# EAGLE schematic DIS06043H-ESP32-V2.020231204 (EAGLE 9.5.1)
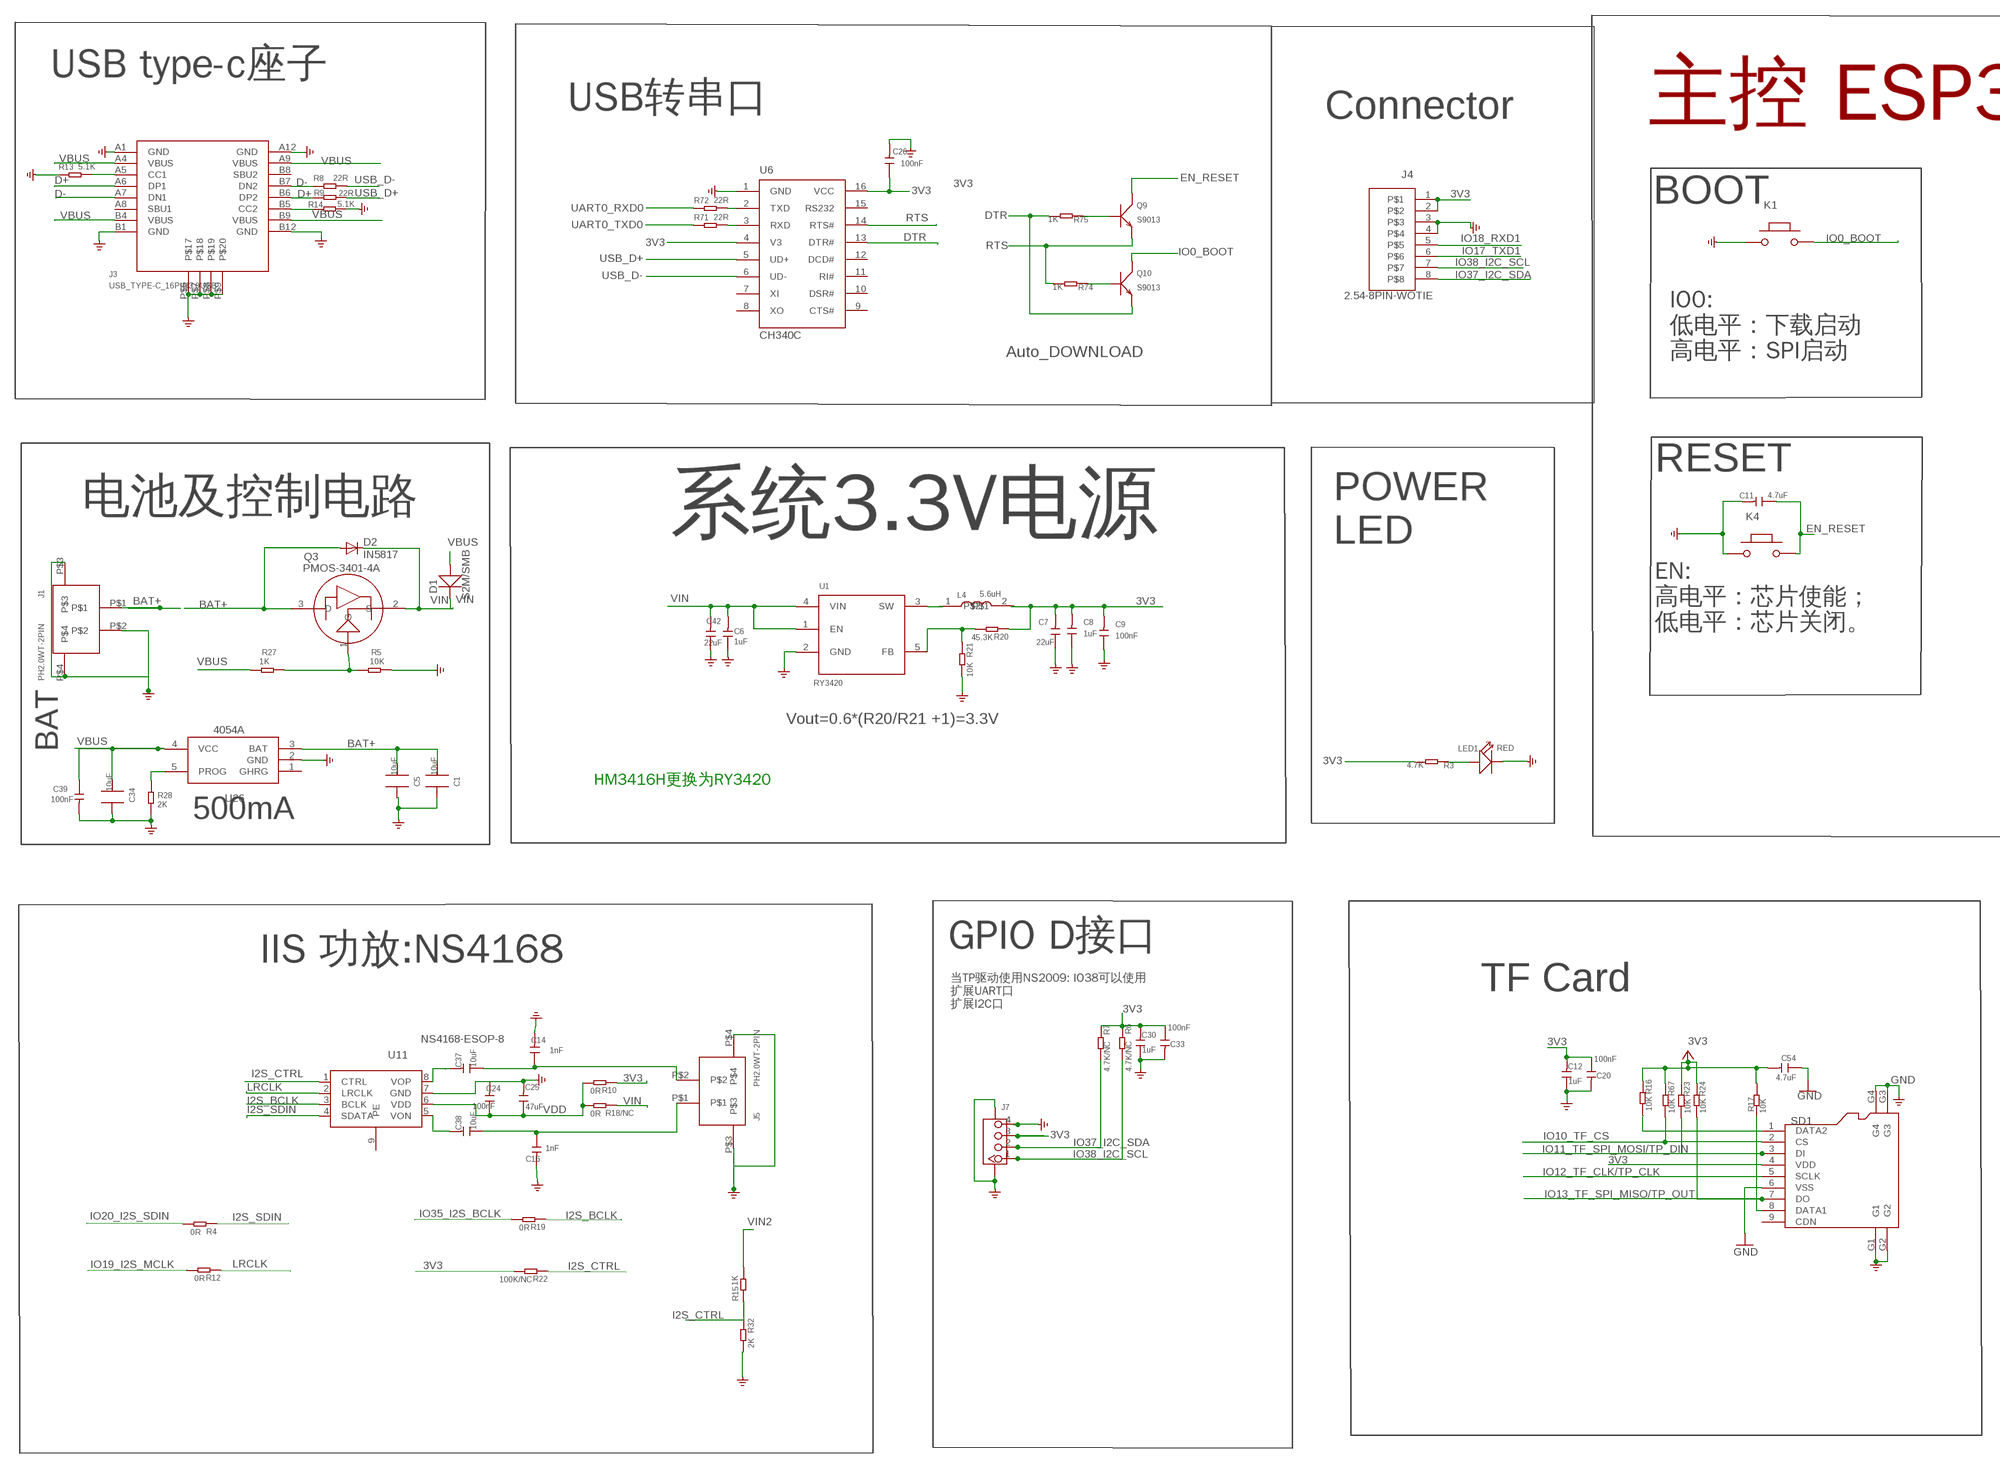
[diagram p0: schematic, sheet 1, part 1 of 2]
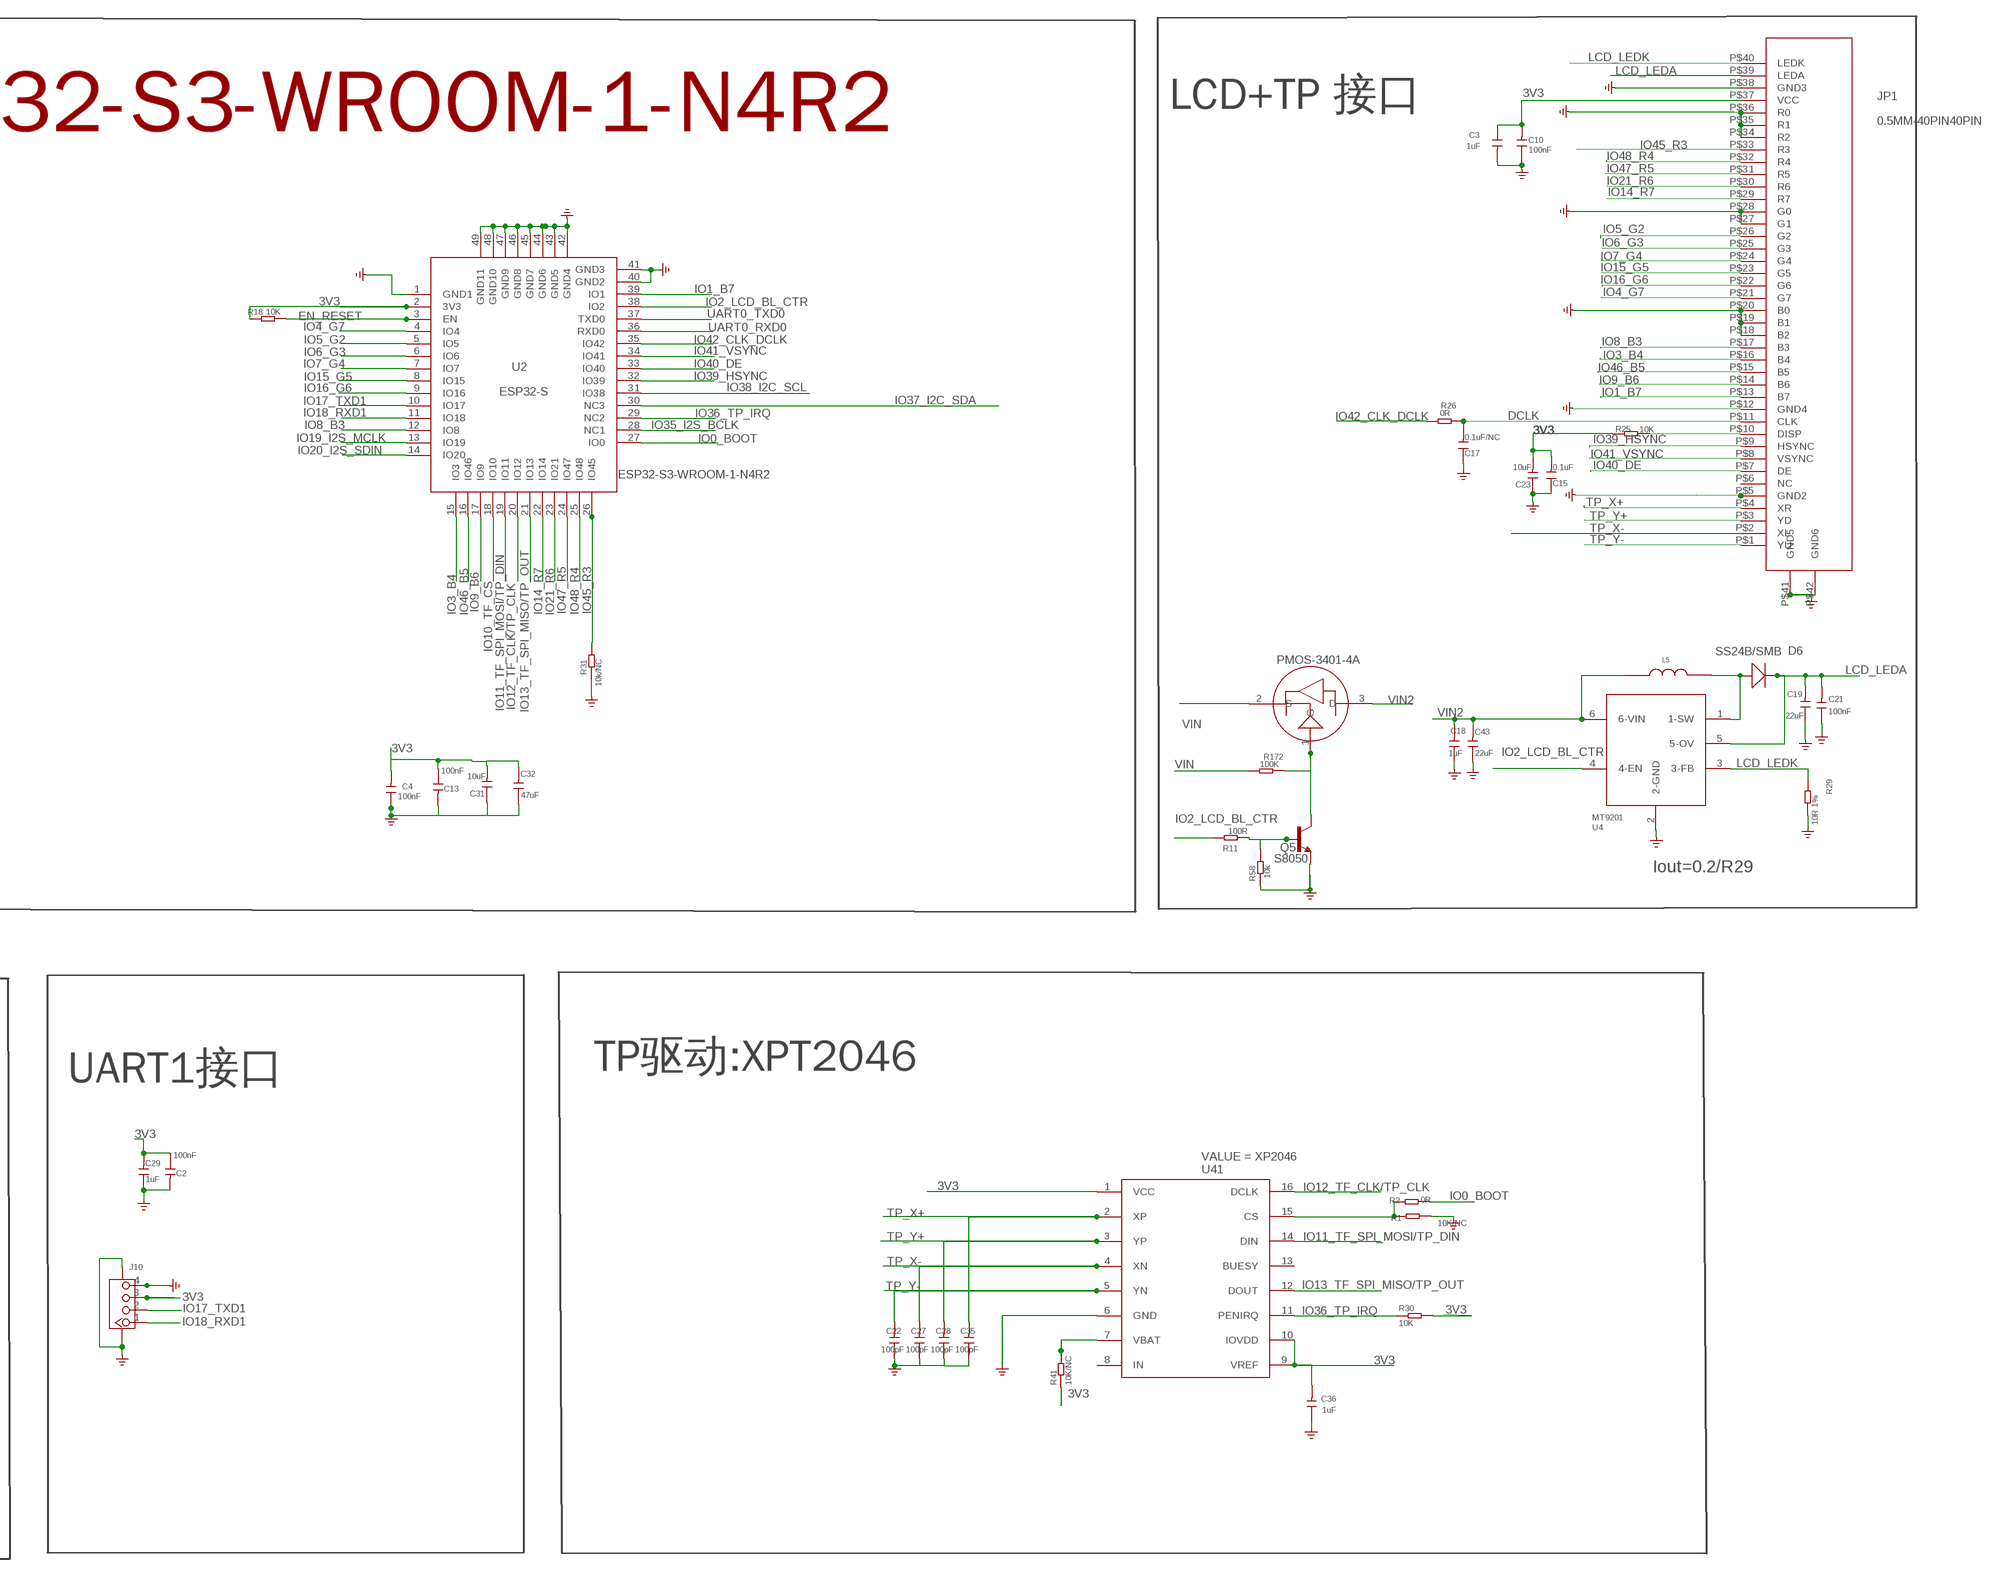
[diagram p1: schematic, sheet 1, part 2 of 2]

## Parts
C1  10uF  C0805_S  [0805_S]
C2  100nF  C-0603  [C0603]
C3  1uF  C-0603  [C0603]
C4  100nF  C-0603  [C0603]
C5  10uF  C0805_S  [0805_S]
C6  1uF  C0603  [0603]
C7  22uF  C0805  [0805]
C8  1uF  C0603  [0603]
C9  100nF  C0603  [0603]
C10  100nF  C-0603  [C0603]
C11  4.7uF  C0603  [0603]
C12  1uF  DISCRETE_C-0603  [DISCRETE_C0603]
C13  100nF  C-0603  [C0603]
C14  1nF  C-0603  [C0603]
C15  0.1uF  DISCRETE_C-0603  [DISCRETE_C0603]
C16  1nF  C-0603  [C0603]
C17  0.1uF/NC  DISCRETE_C-0603  [DISCRETE_C0603]
C18  1uF  C0603  [0603]
C19  22uF  C0805  [0805]
C20  100nF  C-0603  [C0603]
C21  100nF  C0603  [0603]
C22  100pF  C0603  [0603]
C23  10uF  DISCRETE_C-0603  [DISCRETE_C0603]
C24  100nF  C-0603  [C0603]
C25  47uF  C0805  [0805]
C26  100nF  C0603  [0603]
C27  100pF  C0603  [0603]
C28  100pF  C0603  [0603]
C29  1uF  DISCRETE_C-0603  [DISCRETE_C0603]
C30  1uF  DISCRETE_C-0603  [DISCRETE_C0603]
C31  10uF  DISCRETE_C-0603  [DISCRETE_C0603]
C32  47uF  C0805  [0805]
C33  100nF  C-0603  [C0603]
C34  10uF  C0805_S  [0805_S]
C35  100pF  C0603  [0603]
C36  1uF  DISCRETE_C-0603  [DISCRETE_C0603]
C37  10uF  DISCRETE_C-0603  [DISCRETE_C0603]
C38  10uF  DISCRETE_C-0603  [DISCRETE_C0603]
C39  100nF  C-0603  [C0603]
C42  22uF  C0805  [0805]
C43  22uF  C0805  [0805]
C54  4.7uF  DISCRETE_C-0603  [DISCRETE_C0603]
D1  S2M/SMB  214ABDO-214AB  [214AB]
D2  IN5817  DIODE-DO-214AC  [DO-214AC]
D6  SS24B/SMB  214ABDO-214AB  [214AB]
J1  PH2.0WT-2PIN  [PH2.0WT-2PIN]
J3  USB_TYPE-C_16PIN3.0USB  [KEVIN_3.0TYPEC-SMD]
J4  2.54-8PIN-WOTIE  [2.54-8P-WOTIE]
J5  PH2.0WT-2PIN  [PH2.0WT-2PIN]
J7  CONNECTOR_TWIG-4P-2.0-SMD-FEMALE-REINFORCE90D  [CONNECTOR_4P-SMD-2.0-90D]
J10  CONNECTOR_TWIG-4P-2.0-SMD-FEMALE-REINFORCE90D  [CONNECTOR_4P-SMD-2.0-90D]
JP1  0.5MM-40PIN40PIN  [0.5MM*40P]
K1  BUTTON  PB157  [157SW]
K4  BUTTON  PB157  [157SW]
L4  5.6uH  L-0530  [CD54_CD54]
L5  CD32_6.8uH  CD32_950MA  [CD32]
LED1  RED  DISCRETE_LED0603  [DISCRETE_LED-0603]
Q3  PMOS-3401-4A  P-MOS-SOT23  [SOT-23]
Q5  S8050  SPARKFUN_TRANSISTOR_NPNSOT23  [SPARKFUN_SOT23]
Q9  S9013  TRANSISTOR-NPN-SOT23  [SOT23@1]
Q10  S9013  TRANSISTOR-NPN-SOT23  [SOT23@1]
Q30  PMOS-3401-4A  P-MOS-SOT23  [SOT-23]
R1  10K/NC  R0603  [R0603]
R2  0R  DISCRETE_R-0603  [DISCRETE_R0603]
R3  4.7K  DISCRETE_R-0603  [DISCRETE_R0603]
R4  0R  DISCRETE_R-0603  [DISCRETE_R0603]
R5  10K  DISCRETE_R-0603  [DISCRETE_R0603]
R6  4.7K/NC  DISCRETE_R-0603  [DISCRETE_R0603]
R7  4.7K/NC  DISCRETE_R-0603  [DISCRETE_R0603]
R8  22R  DISCRETE_R-0603  [DISCRETE_R0603]
R9  22R  DISCRETE_R-0603  [DISCRETE_R0603]
R10  0R  DISCRETE_R-0603  [DISCRETE_R0603]
R11  100R  R0603  [R0603]
R12  0R  DISCRETE_R-0603  [DISCRETE_R0603]
R13  5.1K  DISCRETE_R-0603  [DISCRETE_R0603]
R14  5.1K  DISCRETE_R-0603  [DISCRETE_R0603]
R15  1K  DISCRETE_R-0603  [DISCRETE_R0603]
R16  10K  DISCRETE_R-0603  [DISCRETE_R0603]
R17  10K  DISCRETE_R-0603  [DISCRETE_R0603]
R18  10K  DISCRETE_R-0603  [DISCRETE_R0603]
R18/NC  0R  DISCRETE_R-0603  [DISCRETE_R0603]
R19  0R  DISCRETE_R-0603  [DISCRETE_R0603]
R20  45.3K  DISCRETE_R-0603  [DISCRETE_R0603]
R21  10K  DISCRETE_R-0603  [DISCRETE_R0603]
R22  100K/NC  DISCRETE_R-0603  [DISCRETE_R0603]
R23  10K  DISCRETE_R-0603  [DISCRETE_R0603]
R24  10K  DISCRETE_R-0603  [DISCRETE_R0603]
R25  10K  DISCRETE_R-0603  [DISCRETE_R0603]
R26  0R  R-0603  [R0603]
R27  1K  DISCRETE_R-0603  [DISCRETE_R0603]
R28  2K  DISCRETE_R-0603  [DISCRETE_R0603]
R29  10R 1%  DISCRETE_R-0603  [DISCRETE_R0603]
R30  10K  DISCRETE_R-0603  [DISCRETE_R0603]
R31  10k/NC  R0603  [R0603]
R32  2K  DISCRETE_R-0603  [DISCRETE_R0603]
R41  10K/NC  DISCRETE_R-0603  [DISCRETE_R0603]
R58  10k  R0603  [R0603]
R67  10K  DISCRETE_R-0603  [DISCRETE_R0603]
R71  22R  DISCRETE_R-0603  [DISCRETE_R0603]
R72  22R  DISCRETE_R-0603  [DISCRETE_R0603]
R74  1K  DISCRETE_R-0603  [DISCRETE_R0603]
R75  1K  DISCRETE_R-0603  [DISCRETE_R0603]
R172  100K  R-0603  [R0603]
SD1  HOLDER-MICROSD-9P  [9P-SMD-W/-RING]
U1  RY3420  A_XBJ_HM3420B  [A_XBJ_SOT23-5]
U2  ESP32-S  [ESP32-S3]
U4  MT9201  [SOT23-6]
U6  CH340C  CH340G  [SOP-16]
U11  NS4168-ESOP-8  [NS4168-ESOP-8]
U26  4054A  [SOP23-5]
U41  XP2046  [XP2046-SSOP16]

## Nets
3V3: C2.1 C3.1 C4.2 C7.2 C8.2 C9.2 C10.2 C12.2 C13.1 C15.2 C20.1 C23.2 C26.1 C29.2 C30.2 C31.2 C32.2 C33.1 C36.2 C54.2 J4.1 J4.2 J7.3 J10.3 JP1.P$37(VCC) L4.2 R3.2 R6.1 R7.1 R10.1 R16.1 R17.1 R18.1 R20.1 R22.2 R23.1 R24.1 R25.1 R30.2 R41.1 R67.1 SD1.4(VDD) U2.2(3V3) U6.4(V3) U6.16(VCC) U41.1(VCC) U41.9(VREF) U41.10(IOVDD) ; supply symbol labelled +3V3
BAT+: C1.2 C5.2 D2.A J1.P$1 Q3.3(D) U26.3(BAT)
D+: J3.A6(DP1) J3.B6(DP2) R9.1
D-: J3.A7(DN1) J3.B7(DN2) R8.1
DCLK: C17.2 JP1.P$11(CLK) R26.2
DTR: Q10.2(E) R75.2 U6.13(DTR#)
EN_RESET: C11.1 K4.2 Q9.3(C) R18.2 U2.3(EN)
GND: C1.1 C2.2 C3.2 C4.1 C5.1 C6.1 C7.1 C8.1 C9.1 C10.1 C11.2 C12.1 C13.2 C14.2 C15.1 C16.2 C17.1 C18.1 C19.1 C20.2 C21.1 C22.1 C23.1 C24.2 C25.2 C26.2 C27.1 C28.1 C29.1 C30.1 C31.1 C32.1 C33.2 C34.1 C35.1 C36.1 C39.2 C42.1 C43.1 C54.1 J1.P$2 J1.P$3 J1.P$4 J3.A1(GND) J3.A12(GND) J3.B1(GND) J3.B12(GND) J3.P$6 J3.P$7 J3.P$8 J3.P$9 J4.3 J4.4 J5.P$3 J5.P$4 J7.4 J7.SS1 J7.SS2 J10.4 J10.SS1 J10.SS2 JP1.P$5(GND2) JP1.P$12(GND4) JP1.P$18(B2) JP1.P$19(B1) JP1.P$20(B0) JP1.P$27(G1) JP1.P$28(G0) JP1.P$34(R2) JP1.P$35(R1) JP1.P$36(R0) JP1.P$38(GND3) JP1.P$41(GND5) JP1.P$42(GND6) K1.1 K4.1 LED1.- Q5.2(E) R1.1 R5.1 R13.1 R14.2 R21.2 R28.2 R29.2 R31.1 R32.2 R58.1 SD1.6(VSS) SD1.G1 SD1.G2 SD1.G3 SD1.G4 U1.2(GND) U2.1(GND1) U2.40(GND2) U2.41(GND3) U2.42(GND4) U2.43(GND5) U2.44(GND6) U2.45(GND7) U2.46(GND8) U2.47(GND9) U2.48(GND10) U2.49(GND11) U4.2(2-GND) U6.1(GND) U11.7(GND) U26.2(GND) U41.6(GND)
I2S_BCLK: R19.1 U11.3(BCLK)
I2S_CTRL: R15.1 R22.1 R32.1 U11.1(CTRL)
I2S_SDIN: R4.1 U11.4(SDATA)
IO0_BOOT: K1.2 Q10.3(C) R2.1 U2.27(IO0)
IO1_B7: JP1.P$13(B7) U2.39(IO1)
IO2_LCD_BL_CTR: R11.2 U2.38(IO2) U4.4(4-EN)
IO3_B4: JP1.P$16(B4) U2.15(IO3)
IO4_G7: JP1.P$21(G7) U2.4(IO4)
IO5_G2: JP1.P$26(G2) U2.5(IO5)
IO6_G3: JP1.P$25(G3) U2.6(IO6)
IO7_G4: JP1.P$24(G4) U2.7(IO7)
IO8_B3: JP1.P$17(B3) U2.12(IO8)
IO9_B6: JP1.P$14(B6) U2.17(IO9)
IO10_TF_CS: R67.2 SD1.2(CS) U2.18(IO10)
IO11_TF_SPI_MOSI/TP_DIN: R23.2 SD1.3(DI) U2.19(IO11) U41.14(DIN)
IO12_TF_CLK/TP_CLK: SD1.5(SCLK) U2.20(IO12) U41.16(DCLK)
IO13_TF_SPI_MISO/TP_OUT: R24.2 SD1.7(DO) U2.21(IO13) U41.12(DOUT)
IO14_R7: JP1.P$29(R7) U2.22(IO14)
IO15_G5: JP1.P$23(G5) U2.8(IO15)
IO16_G6: JP1.P$22(G6) U2.9(IO16)
IO17_TXD1: J4.6 J10.2 U2.10(IO17)
IO18_RXD1: J4.5 J10.1 U2.11(IO18)
IO19_I2S_MCLK: R12.2 U2.13(IO19)
IO20_I2S_SDIN: R4.2 U2.14(IO20)
IO21_R6: JP1.P$30(R6) U2.23(IO21)
IO35_I2S_BCLK: R19.2 U2.28(NC1)
IO36_TP_IRQ: R30.1 U2.29(NC2) U41.11(PENIRQ)
IO37_I2C_SDA: J4.8 J7.2 R7.2 U2.30(NC3)
IO38_I2C_SCL: J4.7 J7.1 R6.2 U2.31(IO38)
IO39_HSYNC: JP1.P$9(HSYNC) U2.32(IO39)
IO40_DE: JP1.P$7(DE) U2.33(IO40)
IO41_VSYNC: JP1.P$8(VSYNC) U2.34(IO41)
IO42_CLK_DCLK: R26.1 U2.35(IO42)
IO45_R3: JP1.P$33(R3) R31.2 U2.26(IO45)
IO46_B5: JP1.P$15(B5) U2.16(IO46)
IO47_R5: JP1.P$31(R5) U2.24(IO47)
IO48_R4: JP1.P$32(R4) U2.25(IO48)
LCD_LEDA: C19.2 C21.2 D6.2(-) JP1.P$39(LEDA) U4.5(5-OV)
LCD_LEDK: JP1.P$40(LEDK) R29.1 U4.3(3-FB)
LRCLK: R12.1 U11.2(LRCLK)
N$1: LED1.+ R3.1
N$2: R41.2 U41.7(VBAT)
N$3: C37.2 U11.8(VOP)
N$6: C14.1 C37.1 J5.P$2
N$7: JP1.P$10(DISP) R25.2
N$9: R1.2 R2.2 U41.15(CS)
N$10: C16.1 C38.1 J5.P$1
N$11: J3.A5(CC1) R13.2
N$12: C38.2 U11.5(VON)
N$13: L4.1 U1.3(SW)
N$14: R28.1 U26.5(PROG)
N$15: Q3.1(G) R5.2 R27.1
N$16: D6.1(+) L5.2 U4.1(1-SW)
N$17: J3.B5(CC2) R14.1
N$20: R20.2 R21.1 U1.5(FB)
N$23: Q5.1(B) R11.1 R58.2
N$32: Q9.1(B) R75.1
N$36: Q5.3(C) Q30.1(G) R172.2
N$38: Q10.1(B) R74.1
N$40: R72.2 U6.2(TXD)
N$42: R71.2 U6.3(RXD)
N$47: R16.2 SD1.1(DATA2)
N$48: R17.2 SD1.8(DATA1)
RTS: Q9.2(E) R74.2 U6.14(RTS#)
TP_X+: C35.2 JP1.P$4(XR) U41.2(XP)
TP_X-: C27.2 JP1.P$2(XL) U41.4(XN)
TP_Y+: C28.2 JP1.P$3(YD) U41.3(YP)
TP_Y-: C22.2 JP1.P$1(YU) U41.5(YN)
UART0_RXD0: R72.1 U2.36(RXD0)
UART0_TXD0: R71.1 U2.37(TXD0)
USB_D+: R9.2 U6.5(UD+)
USB_D-: R8.2 U6.6(UD-)
VBUS: C34.2 C39.1 D1.1(+) J3.A4(VBUS) J3.A9(VBUS) J3.B4(VBUS) J3.B9(VBUS) R27.2 U26.4(VCC)
VDD: C24.1 C25.1 R10.2 R18/NC.2 U11.6(VDD)
VIN: C6.2 C42.2 D1.2(-) D2.C Q3.2(S) Q30.2(S) R18/NC.1 R172.1 U1.1(EN) U1.4(VIN)
VIN2: C18.2 C43.2 L5.1 Q30.3(D) R15.2 U4.6(6-VIN)
Unconnected: J3.A8(SBU1) J3.B8(SBU2) JP1.P$6(NC) SD1.9(CDN) U6.7(XI) U6.8(XO) U6.9(CTS#) U6.10(DSR#) U6.11(RI#) U6.12(DCD#) U6.15(RS232) U11.9(PE) U26.1(GHRG) U41.8(IN) U41.13(BUESY)

## Notes on the sheet
- USB type-c座子
- USB转串口 | LCD+TP 接口
- Connector | 主控 ESP32-S3-WROOM-1-N4R2
- BOOT
- Auto_DOWNLOAD
- IO0:
  低电平：下载启动
  高电平：SPI启动
- RESET
- 电池及控制电路
- 系统3.3V电源
- POWER
  LED
- EN:
  高电平：芯片使能；
  低电平：芯片关闭。
- Vout=0.6*(R20/R21 +1)=3.3V
- BAT
- HM3416H更换为RY3420
- Iout=0.2/R29
- 500mA
- GPIO D接口
- IIS 功放:NS4168
- TF Card | UART1接口 | TP驱动:XPT2046
- 当TP驱动使用NS2009: IO38可以使用
  扩展UART口
  扩展I2C口

## Library data of the parts
C1 C5 C34 = CPT_SMD:C0805
C2-C4 C10 C13 C14 C16 C20 C24 C33 C39 = discrete:C*: Ceramic Capacitors
C6 C8 C9 C11 C18 C21 C22 C26-C28 C35 = A_xbj:C0603
C7 C19 C25 C32 C42 C43 = A_xbj:C0805
C12 C29 C30 C36-C38 = A_xbj:DISCRETE_C*: Ceramic Capacitors
C15 C17 C23 C31 C54 = A9G:DISCRETE_C*: Ceramic Capacitors
D1 D6 = DO-214AB:214AB: 214AB
D2 = diode:DIODE-: DIODE
J1 J5 = cooper:PH2.0WT-2PIN
J3 = WZ3532R024-ESP32-V0.1-20221226:USB_TYPE-C_16PIN
J4 = cooper:2.54-8PIN-WOTIE
J7 J10 = A_xbj:CONNECTOR_TWIG-4P-2.0-SMD-FEMALE-REINFORCE
JP1 = cooper:0.5MM-40PIN
K1 K4 = MySMD:PB157
L4 = WZ2432R028-ESP32-V1.2-20231108:L-0530
L5 = CD54:CD32_950MA
LED1 = A_xbj:DISCRETE_LED*
Q3 Q30 = DFN8:P-MOS-SOT23
Q5 = Adafruit_HUZZAH32_ESP32_Feather:SPARKFUN_TRANSISTOR_NPN: Transistor NPN BJT configuration in SOT23 package. MMBT2222 is the common NPN we use. Double check BCE configuration again layout.
Q9 Q10 = discrete:TRANSISTOR-NPN*: NPN audion
R1 R11 R31 R58 = cooper:R0603
R2-R4 R6-R10 R12-R18 R18/NC R19-R25 R29 R32 R67 R71 R72 R74 R75 = Crowtail-_LED-V2.0-20190615-01:DISCRETE_R*
R5 R27 R28 R30 R41 = A9G:DISCRETE_R*
R26 R172 = discrete:R*
SD1 = Connector:HOLDER-MICROSD-9P
U1 = CrowBot_-V1.0-20220525:A_XBJ_HM3420B
U2 = DW1000:ESP32-S; U2: ESP32-S3-WROOM-1-N4R2
U4 = cooper:MT9201
U6 = A_xbj:CH340G
U11 = STC_MCUSTC8G1K08A:NS4168-ESOP-8
U26 = DFN8:4054A
U41 = cooper:XP2046

## Net classes
0 default: width 0.152 mm, drill 0.305 mm, clearance 0.203 mm